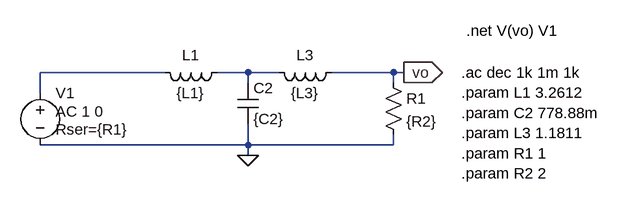
[diagram p0: schematic ejercicio3.asc]
ejercicio3.asc, the LTspice schematic file:
Version 4
SHEET 1 956 680
WIRE 64 112 -128 112
WIRE 192 112 144 112
WIRE 240 112 192 112
WIRE 416 112 320 112
WIRE 432 112 416 112
WIRE 192 128 192 112
WIRE 416 128 416 112
WIRE -128 144 -128 112
WIRE 192 224 192 192
WIRE 192 224 -128 224
WIRE 416 224 416 208
WIRE 416 224 192 224
WIRE 192 240 192 224
FLAG 192 240 0
FLAG 432 112 vo
IOPIN 432 112 Out
SYMBOL ind 160 96 R90
WINDOW 0 5 56 VBottom 2
WINDOW 3 32 56 VTop 2
SYMATTR InstName L1
SYMATTR Value {L1}
SYMATTR SpiceLine Rser=0
SYMBOL ind 336 96 R90
WINDOW 0 5 56 VBottom 2
WINDOW 3 32 56 VTop 2
SYMATTR InstName L3
SYMATTR Value {L3}
SYMATTR SpiceLine Rser=0
SYMBOL cap 176 128 R0
SYMATTR InstName C2
SYMATTR Value {C2}
SYMATTR SpiceLine Rser=0
SYMBOL res 400 112 R0
SYMATTR InstName R1
SYMATTR Value {R2}
SYMBOL voltage -128 128 R0
WINDOW 3 26 82 Left 2
WINDOW 123 24 44 Left 2
WINDOW 39 24 72 Left 2
SYMATTR Value ""
SYMATTR InstName V1
SYMATTR Value2 AC 1 0
SYMATTR SpiceLine Rser={R1}
TEXT 520 112 Left 2 !.ac dec 1k 1m 1k\n.param L1 3.2612\n.param C2 778.88m\n.param L3 1.1811\n.param R1 1\n.param R2 2
TEXT 528 48 Left 2 !.net V(vo) V1

The netlist it stands for:
* ejercicio3.asc
L1 N002 N001 {L1} Rser=0
L3 vo N002 {L3} Rser=0
C2 N002 0 {C2} Rser=0
R1 vo 0 {R2}
V1 N001 0 AC 1 0 Rser={R1}
.ac dec 1k 1m 1k
.param L1 3.2612
.param C2 778.88m
.param L3 1.1811
.param R1 1
.param R2 2
.net V(vo) V1
.backanno
.end